# EAGLE design 4AND_1 (EAGLE 6.5.0)
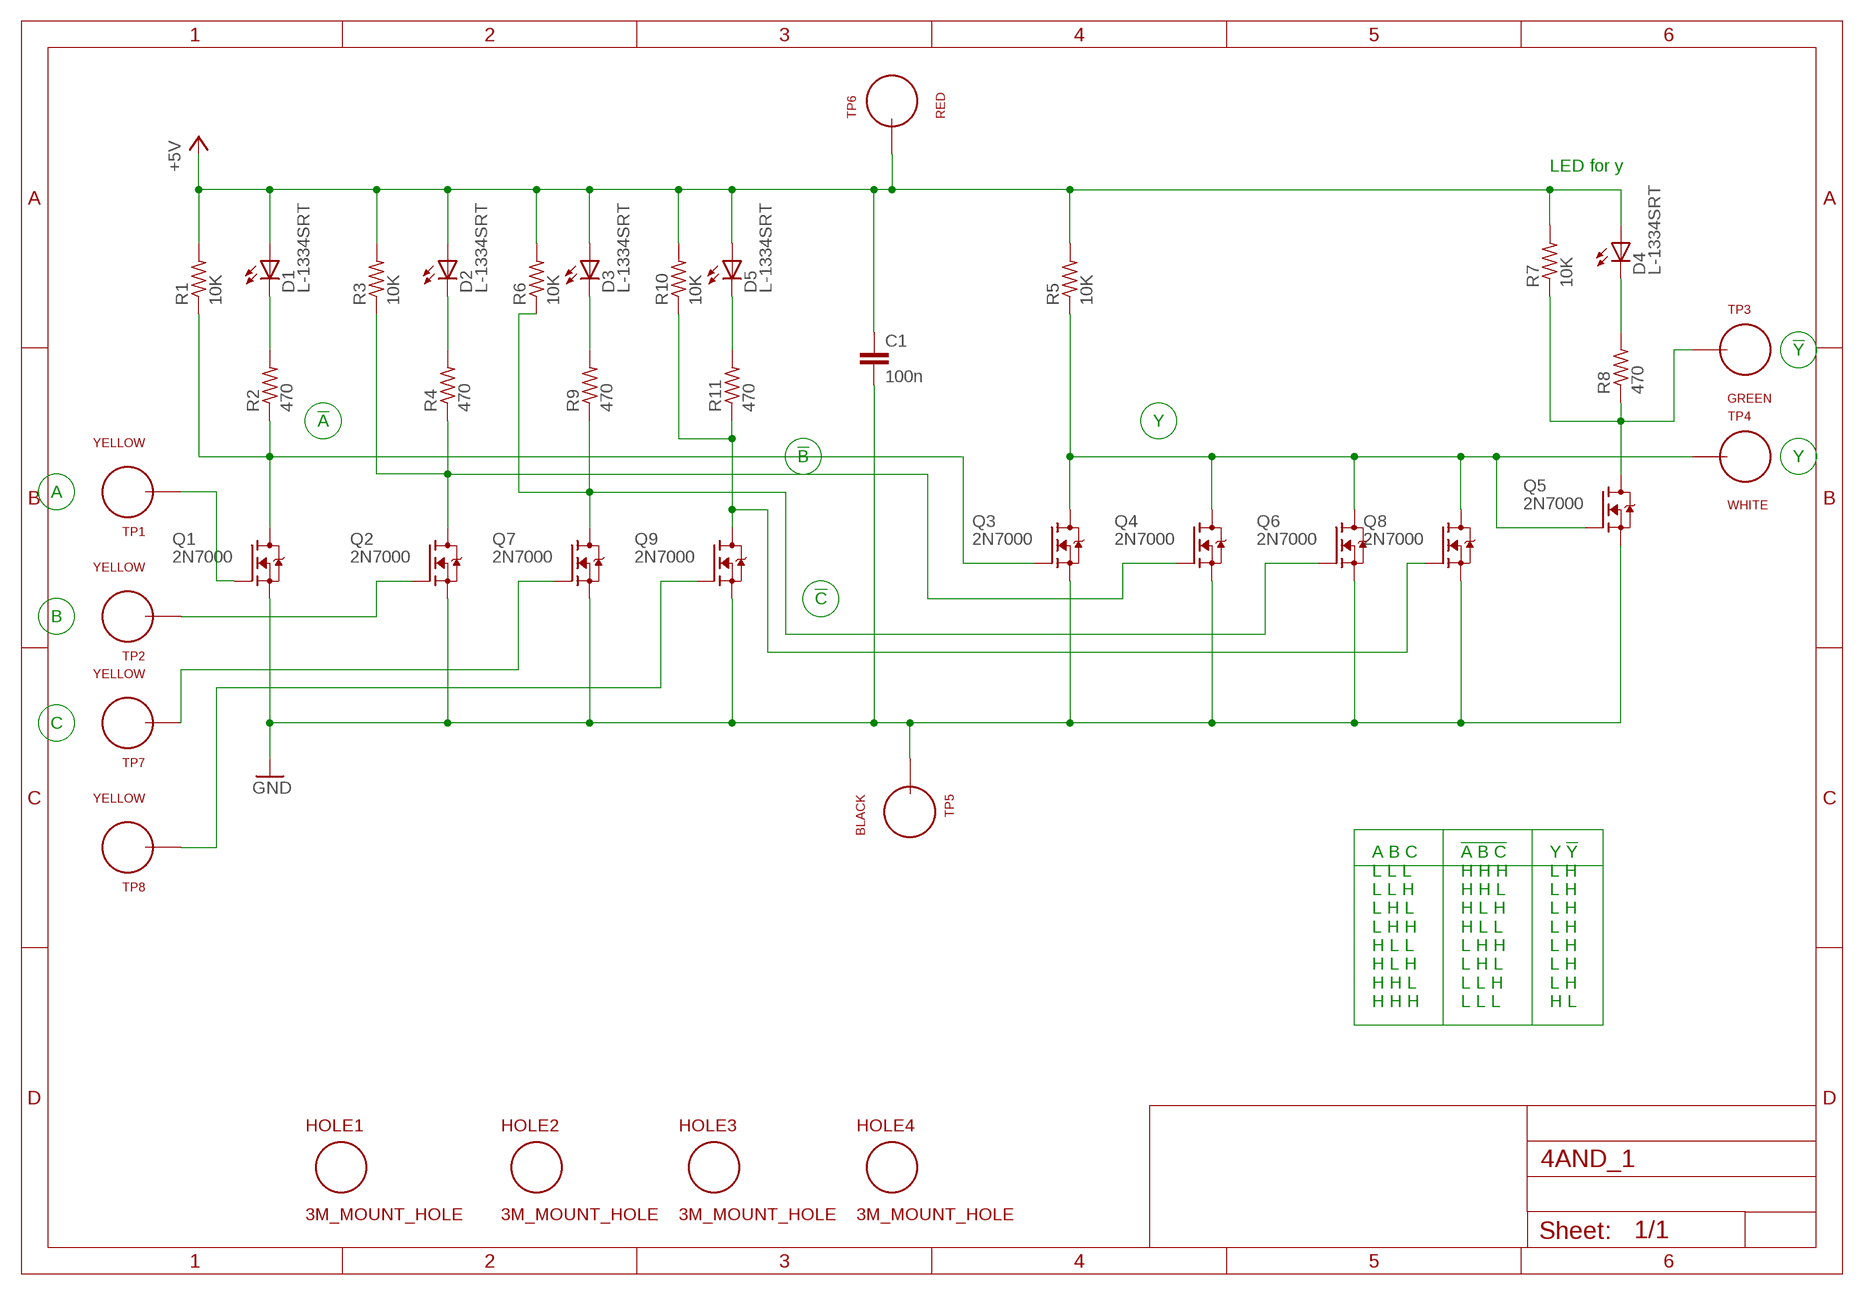
[diagram p0: schematic, sheet 1]

## Parts
C1  100n  C_P2INCH  [CAP_P2INCH]
D1  L-1334SRT  [LED3MM]
D2  L-1334SRT  [LED3MM]
D3  L-1334SRT  [LED3MM]
D4  L-1334SRT  [LED3MM]
D5  L-1334SRT  [LED3MM]
HOLE1  3M_MOUNT_HOLE  [3M_HOLE]
HOLE2  3M_MOUNT_HOLE  [3M_HOLE]
HOLE3  3M_MOUNT_HOLE  [3M_HOLE]
HOLE4  3M_MOUNT_HOLE  [3M_HOLE]
Q1  2N7000  [TO92-DGS]
Q2  2N7000  [TO92-DGS]
Q3  2N7000  [TO92-DGS]
Q4  2N7000  [TO92-DGS]
Q5  2N7000  [TO92-DGS]
Q6  2N7000  [TO92-DGS]
Q7  2N7000  [TO92-DGS]
Q8  2N7000  [TO92-DGS]
Q9  2N7000  [TO92-DGS]
R1  10K  R_P2INCH  [R_P2INCH]
R2  470  R_P2INCH  [R_P2INCH]
R3  10K  R_P2INCH  [R_P2INCH]
R4  470  R_P2INCH  [R_P2INCH]
R5  10K  R_P2INCH  [R_P2INCH]
R6  10K  R_P2INCH  [R_P2INCH]
R7  10K  R_P2INCH  [R_P2INCH]
R8  470  R_P2INCH  [R_P2INCH]
R9  470  R_P2INCH  [R_P2INCH]
R10  10K  R_P2INCH  [R_P2INCH]
R11  470  R_P2INCH  [R_P2INCH]
TP1  YELLOW  TEST_LOOP  [TEST_LOOP]
TP2  YELLOW  TEST_LOOP  [TEST_LOOP]
TP3  GREEN  TEST_LOOP  [TEST_LOOP]
TP4  WHITE  TEST_LOOP  [TEST_LOOP]
TP5  BLACK  TEST_LOOP  [TEST_LOOP]
TP6  RED  TEST_LOOP  [TEST_LOOP]
TP7  YELLOW  TEST_LOOP  [TEST_LOOP]
TP8  YELLOW  TEST_LOOP  [TEST_LOOP]

## Nets
+5V: C1.1 D1.A D2.A D3.A D4.A D5.A R1.2 R3.2 R5.2 R6.2 R7.2 R10.2 TP6.P$1
GND: C1.2 Q1.S Q2.S Q3.S Q4.S Q5.S Q6.S Q7.S Q8.S Q9.S TP5.P$1
N$1: Q3.D Q4.D Q5.G Q6.D Q8.D R5.1 TP4.P$1
N$2: D3.K(C) R9.2
N$3: D4.K(C) R8.2
N$4: Q5.D R7.1 R8.1 TP3.P$1
N$5: Q6.G Q7.D R6.1 R9.1
N$6: D2.K(C) R4.2
N$7: Q2.D Q4.G R3.1 R4.1
N$8: D1.K(C) R2.2
N$9: Q1.D Q3.G R1.1 R2.1
N$10: Q7.G TP7.P$1
N$11: Q1.G TP1.P$1
N$12: Q2.G TP2.P$1
N$13: D5.K(C) R11.2
N$16: Q9.G TP8.P$1
N$17: Q8.G Q9.D R10.1 R11.1

## Notes on the sheet
- LED for y
- !Y
- !A | Y
- !B | Y
- A
- !C
- B
- C
- A B C
  L L L
  L L H
  L H L
  L H H
  H L L
  H L H
  H H L
  H H H
- !A B C
  H H H
  H H L
  H L H
  H L L
  L H H
  L H L
  L L H
  L L L
- Y !Y
  L H
  L H
  L H
  L H
  L H
  L H
  L H
  H L

## Library data of the parts
C1 = MyLib:C_P2INCH
D1-D5 = MyLib:L-1334SRT
HOLE1-HOLE4 = MyLib:3M_MOUNT_HOLE
Q1-Q9 = MyLib:2N7000
R1-R11 = MyLib:R_P2INCH
TP1-TP8 = MyLib:TEST_LOOP

## Board
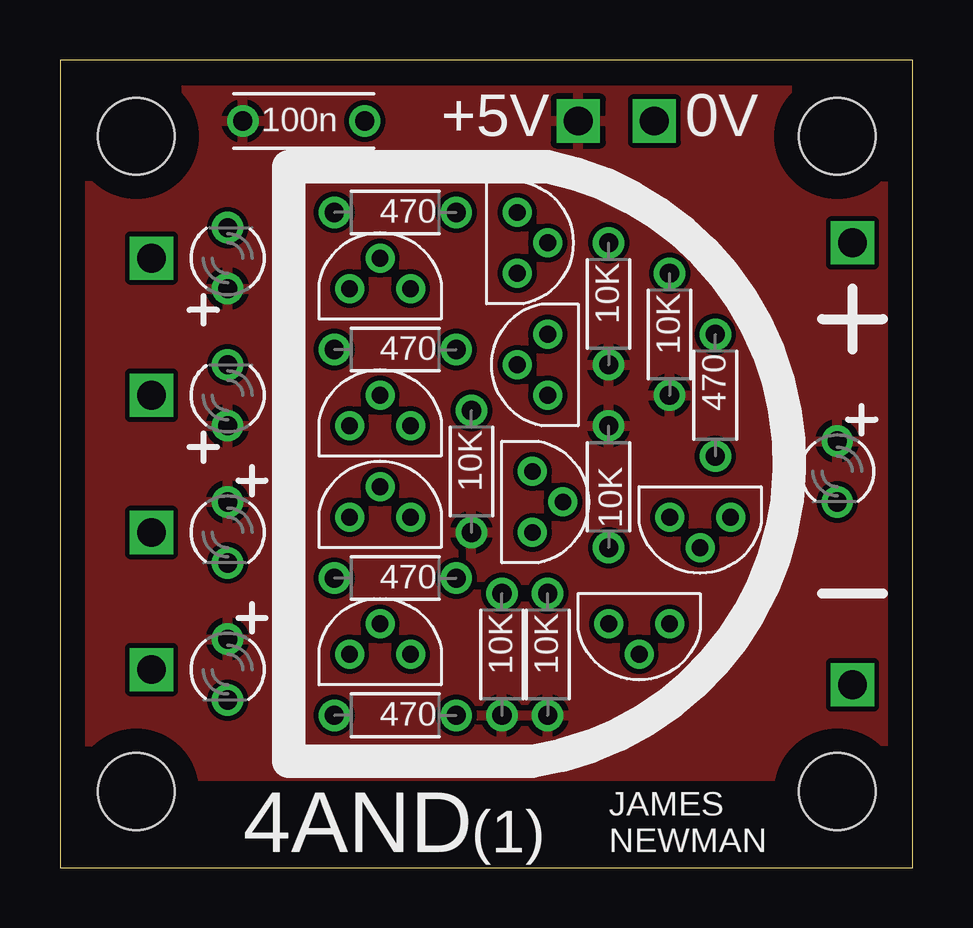
[diagram p1: board, top side]
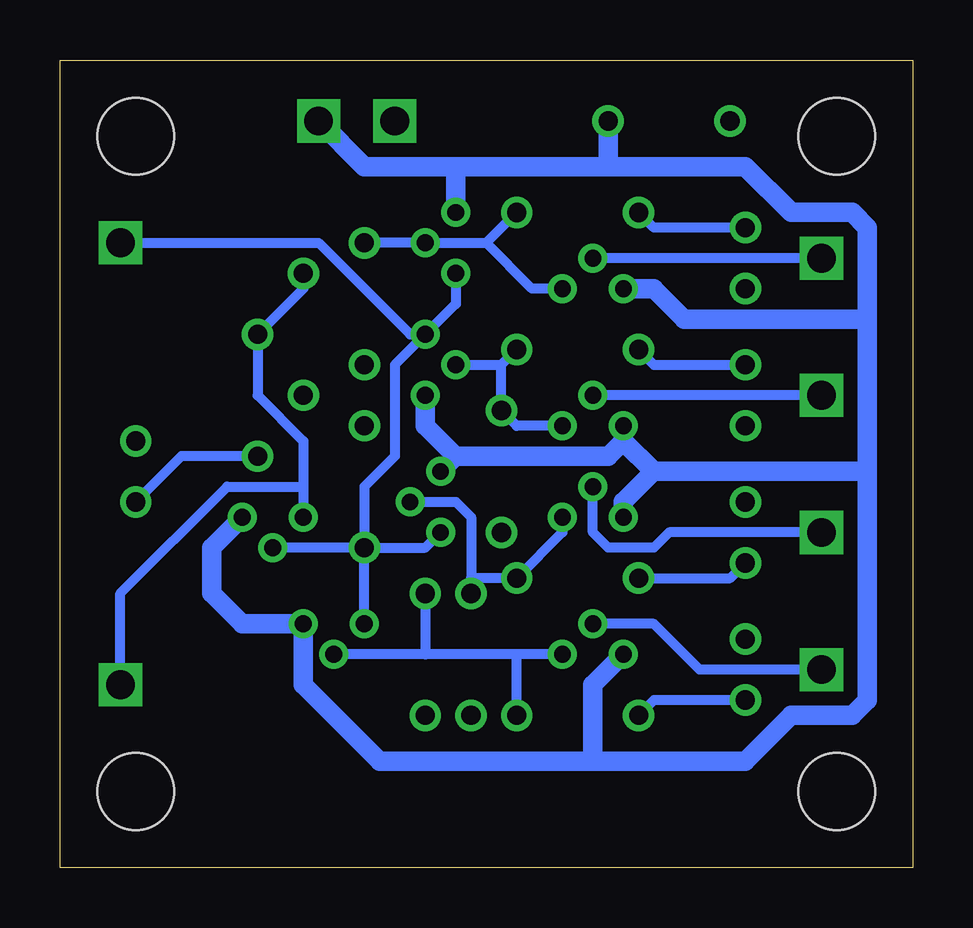
[diagram p2: board, bottom side, seen from below]

Size 35.54 x 33.66 mm. Coordinates in mm from the lower left corner, seen from the top.
Outline: 0,0 35.54,0 35.54,33.66 0,33.66 0,0
Copper layers (1*16): Top 0.035mm / dielectric 1.5mm / Bottom 0.035mm
Design rules "processor_rules *": minimum track width 10mil, minimum drill 0.0236mm, track to track 8mil, track to pad 8mil, pad to pad 8mil, via to via 8mil, smd to smd 8mil, copper to edge 40mil, drill to drill 8mil, minimum pad ring 10mil, minimum via ring 8mil, stop-mask expansion 4mil, vias tented up to drill 0.7mm, thermal gap 10mil

### Footprints (pad centres in the part's own frame; a part is rotated, then mirrored left to right if it is on the bottom)
CAP_P2INCH = drill 0.8: 1 -2.54,0; 2 2.54,0
LED3MM = drill 0.8: A -1.27,0; K 1.27,0
3M_HOLE = hole 3.2: 0,0
TO92-DGS = drill 0.7: D 0,1.27; G -1.27,0; S 0,-1.27
R_P2INCH = drill 0.8: 1 -2.54,0; 2 2.54,0
TEST_LOOP = drill 1.2 square: P$1 0,0

### Placement (x,y rotation side)
C1  10.16,31.11 0 top
D1  6.99,25.4 90 top
D2  6.99,13.97 270 top
D3  6.99,19.68 90 top
D4  32.38,16.51 270 top
D5  6.99,8.26 270 top
HOLE1  3.17,3.17 0 top
HOLE2  3.17,30.48 0 top
HOLE3  32.38,3.17 0 top
HOLE4  32.38,30.48 0 top
Q1  13.34,24.13 270 top
Q2  13.34,14.61 270 top
Q3  19.05,26.04 180 top
Q4  19.68,15.24 180 top
Q5  26.67,14.61 90 top
Q6  20.32,20.95 0 top
Q7  13.34,18.41 270 top
Q8  24.13,10.16 90 top
Q9  13.34,8.89 270 top
R1  22.86,23.5 270 top
R2  13.97,27.3 180 top
R3  18.41,8.89 270 top
R4  13.97,12.06 180 top
R5  22.86,15.88 90 top
R6  17.14,16.51 270 top
R7  25.4,22.23 270 top
R8  27.3,19.68 270 top
R9  13.97,21.59 180 top
R10  20.32,8.89 270 top
R11  13.97,6.35 180 top
TP1  3.81,25.4 0 top
TP2  3.81,13.97 0 top
TP3  33.02,7.62 0 top
TP4  33.02,26.04 0 top
TP5  24.77,31.11 0 top
TP6  21.59,31.11 0 top
TP7  3.81,19.68 0 top
TP8  3.81,8.26 0 top

### Tracks (layer width: path | path; a pad name or v marks a point on that pad's centre or on a via)
+5V
  pour Top: 1.27,32.38 34.29,32.38 34.29,3.81 1.27,3.81
GND
  Bottom 0.813: Q5.S 29.21,13.34 29.21,11.43 27.94,10.16 Q8.S 25.4,7.62 22.23,4.45 13.34,4.45 | 13.34,4.45 6.99,4.45 5.08,6.35 2.54,6.35 1.91,6.99 1.91,16.51 | 1.91,16.51 1.91,22.86 | 1.91,22.86 1.91,26.67 2.54,27.3 5.08,27.3 6.99,29.21 12.7,29.21 | 12.7,29.21 19.05,29.21 | 19.05,29.21 22.86,29.21 TP5.P$1 | Q3.S 19.05,29.21 | Q1.S 10.79,24.13 9.53,22.86 1.91,22.86 | Q2.S 12.06,15.24 10.79,16.51 | 10.79,16.51 1.91,16.51 | Q7.S 12.06,17.78 | 12.06,17.78 10.79,16.51 | Q9.S 13.34,7.62 13.34,4.45 | 12.06,17.78 12.7,17.14 19.05,17.14 | 19.05,17.14 Q4.S | Q6.S 20.32,18.41 19.05,17.14 | C1.2 12.7,29.21
N$1
  Bottom 0.406: Q3.D 19.05,23.5 Q6.D | Q6.D 21.59,20.95 21.59,17.14 22.86,15.88 R5.1 | R5.1 20.32,13.34 Q4.D | Q8.D R5.1 | R5.1 Q5.G | TP4.P$1 24.77,26.04 20.95,22.23 Q6.D
N$2
  Bottom 0.406: R9.2 10.79,20.95 D3.K
N$3
  Bottom 0.406: R8.2 30.48,17.14 D4.K
N$4
  Bottom 0.406: 25.4,15.88 25.4,17.78 27.3,19.68 R8.1 25.4,24.13 R7.1 | 25.4,15.88 Q5.D | TP3.P$1 33.02,11.43 28.57,15.88 25.4,15.88
N$5
  Bottom 0.406: 17.14,20.95 R6.1 16.51,18.41 Q7.D | 17.14,20.95 R9.1 | Q6.G 17.14,20.95
N$6
  Bottom 0.406: R4.2 7.62,12.06 D2.K
N$7
  Bottom 0.406: Q4.G 19.05,15.24 18.41,14.61 18.41,12.06 | 18.41,12.06 R3.1 | 18.41,12.06 R4.1 14.61,13.97 Q2.D
N$8
  Bottom 0.406: D1.K 10.79,26.67 R2.2
N$9
  Bottom 0.406: R1.1 Q3.G 17.78,26.04 | 17.78,26.04 R2.1 | Q1.D 15.88,24.13 17.78,26.04
N$10
  Bottom 0.406: TP7.P$1 Q7.G
N$11
  Bottom 0.406: TP1.P$1 Q1.G
N$12
  Bottom 0.406: TP2.P$1 10.16,13.97 10.79,13.34 12.7,13.34 13.34,13.97 Q2.G
N$13
  Bottom 0.406: D5.K 10.79,6.99 R11.2
N$16
  Bottom 0.406: TP8.P$1 8.89,8.26 10.79,10.16 Q9.G
N$17
  Bottom 0.406: Q9.D 16.51,8.89 | 16.51,8.89 20.32,8.89 | 20.32,8.89 Q8.G | R11.1 16.51,8.89 | R10.1 20.32,8.89

### Text on the board
tPlace: +5V | 0V | 4AND | (1) | JAMES / NEWMAN